# EAGLE schematic boardv2steer (EAGLE 6.6.0)
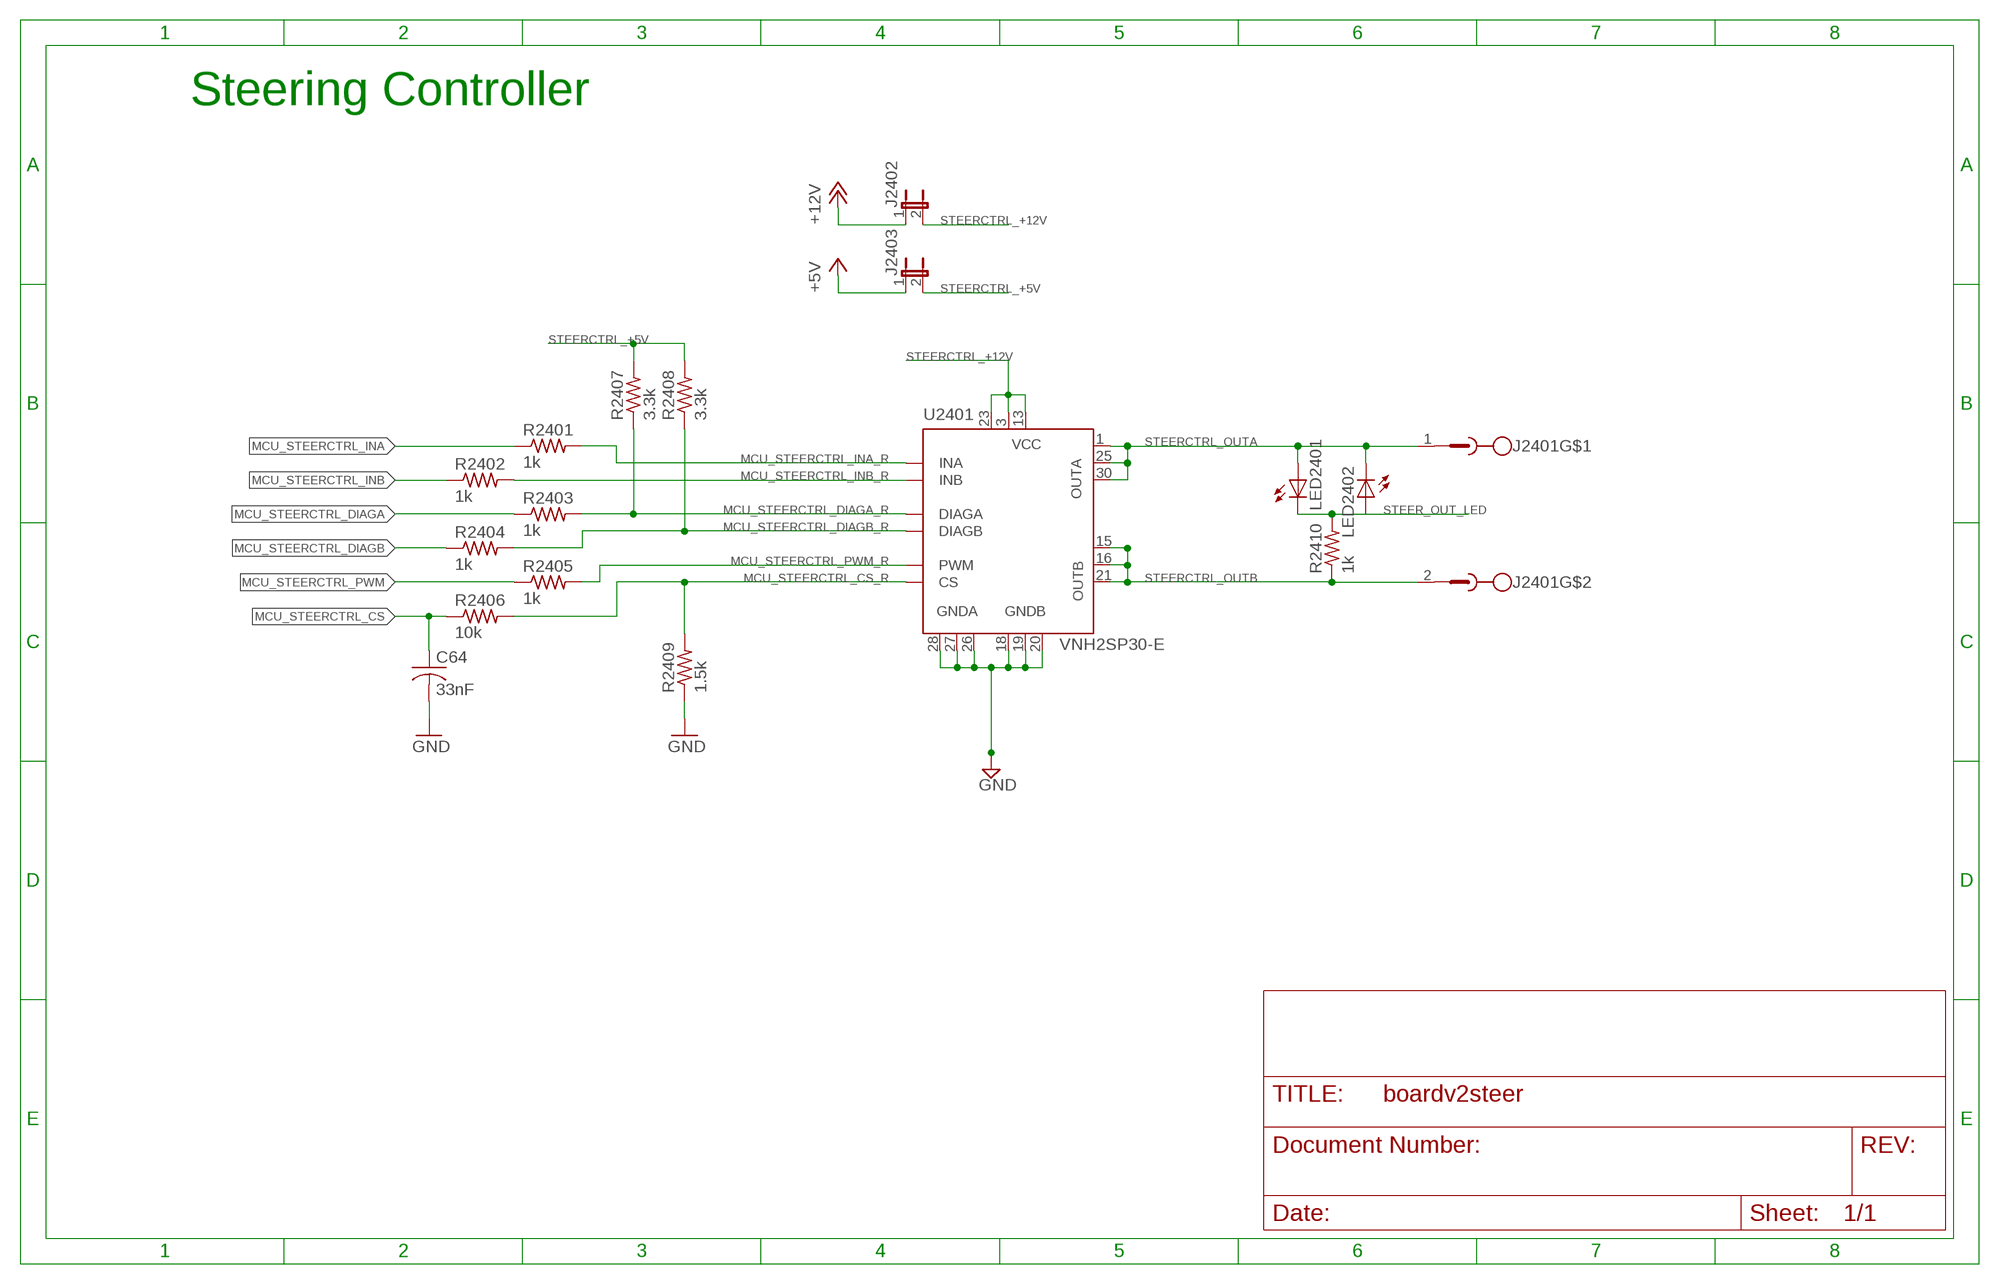
[diagram p0: schematic, sheet 1]

## Parts
C64  33nF  C-USC1206K  [C1206K]
J2401  PHOENIX_2POS_1792863  [PHOENIX_1792863]
J2402  JP1E  [JP1]
J2403  JP1E  [JP1]
LED2401  LEDSML1206  [SML1206]
LED2402  LEDSML1206  [SML1206]
R2401  1k  R-US_R1206W  [R1206W]
R2402  1k  R-US_R1206W  [R1206W]
R2403  1k  R-US_R1206W  [R1206W]
R2404  1k  R-US_R1206W  [R1206W]
R2405  1k  R-US_R1206W  [R1206W]
R2406  10k  R-US_R1206W  [R1206W]
R2407  3.3k  R-US_R1206W  [R1206W]
R2408  3.3k  R-US_R1206W  [R1206W]
R2409  1.5k  R-US_R1206W  [R1206W]
R2410  1k  R-US_R1206W  [R1206W]
U2401  VNH2SP30-E  [MULTIPOWERSO-30]

## Nets
+5V: J2403.1
+12V: J2402.1
GND: C64.2 R2409.1 U2401.18(GNDB) U2401.19(GNDB) U2401.20(GNDB) U2401.26(GNDA) U2401.27(GNDA) U2401.28(GNDA)
MCU_STEERCTRL_CS: C64.1 R2406.1
MCU_STEERCTRL_CS_R: R2406.2 R2409.2 U2401.9(CS)
MCU_STEERCTRL_DIAGA: R2403.1
MCU_STEERCTRL_DIAGA_R: R2403.2 R2407.1 U2401.6(DIAGA)
MCU_STEERCTRL_DIAGB: R2404.1
MCU_STEERCTRL_DIAGB_R: R2404.2 R2408.1 U2401.10(DIAGB)
MCU_STEERCTRL_INA: R2401.1
MCU_STEERCTRL_INA_R: R2401.2 U2401.5(INA)
MCU_STEERCTRL_INB: R2402.1
MCU_STEERCTRL_INB_R: R2402.2 U2401.11(INB)
MCU_STEERCTRL_PWM: R2405.1
MCU_STEERCTRL_PWM_R: R2405.2 U2401.8(PWM)
STEER_OUT_LED: LED2401.C LED2402.A R2410.2
STEERCTRL_+5V: J2403.2 R2407.2 R2408.2
STEERCTRL_+12V: J2402.2 U2401.3(VCC) U2401.13(VCC) U2401.23(VCC)
STEERCTRL_OUTA: J2401.1 LED2401.A LED2402.C U2401.1(OUTA) U2401.25(OUTA) U2401.30(OUTA)
STEERCTRL_OUTB: J2401.2 R2410.1 U2401.15(OUTB) U2401.16(OUTB) U2401.21(OUTB)

## Notes on the sheet
- Steering Controller

## Library data of the parts
C64 = rcl:C-US: CAPACITOR, American symbol
J2401 = Atlanta-Robotics LAPTOP:PHOENIX_2POS_1792863: Phoenix contact 2 position terminal block. 5mm pitch
J2402 J2403 = jumper:JP1E: JUMPER
LED2401 LED2402 = led:LED: LED OSRAM: - CHIPLED LG R971, LG N971, LY N971, LG Q971, LY Q971, LO R971, LY R971 LH N974, LH R974 LS Q976, LO Q976, LY Q976 LO Q996 - Hyper CHIPLED LW Q18S LB Q993, LB Q99A, LB R99A - SideLED LS A670, LO A670, LY A670, LG A670, LP A670 LB A673, LV A673, LT A673, LW A673 LH A674 LY A675 LS A676, LA A676, LO A676, LY A676, LW A676 LS A679, LY A679, LG A679 - Hyper Micro SIDELED® LS Y876, LA Y876, LO Y876, LY Y876 LT Y87S - SmartLED LW L88C, LW L88S LB L89C, LB L89S, LG L890 LS L89K, LO L89K, LY L89K LS L896, LA L896, LO L896, LY L896 - TOPLED LS T670, LO T670, LY T670, LG T670, LP T670 LSG T670, LSP T670, LSY T670, LOP T670, LYG T670 LG T671, LOG T671, LSG T671 LB T673, LV T673, LT T673, LW T673 LH T674 LS T676, LA T676, LO T676, LY T676, LB T676, LH T676, LSB T676, LW T676 LB T67C, LV T67C, LT T67C, LS T67K, LO T67K, LY T67K, LW E67C LS E67B, LA E67B, LO E67B, LY E67B, LB E67C, LV E67C, LT E67C LW T67C LS T679, LY T679, LG T679 LS T770, LO T770, LY T770, LG T770, LP T770 LB T773, LV T773, LT T773, LW T773 LH T774 LS E675, LA E675, LY E675, LS T675 LS T776, LA T776, LO T776, LY T776, LB T776 LHGB T686 LT T68C, LB T68C - Hyper Mini TOPLED® LB M676 - Mini TOPLED Santana® LG M470 LS M47K, LO M47K, LY M47K Source: http://www.osram.convergy.de LUXEON: - LUMILED® LXK2-PW12-R00, LXK2-PW12-S00, LXK2-PW14-U00, LXK2-PW14-V00 LXK2-PM12-R00, LXK2-PM12-S00, LXK2-PM14-U00 LXK2-PE12-Q00, LXK2-PE12-R00, LXK2-PE12-S00, LXK2-PE14-T00, LXK2-PE14-U00 LXK2-PB12-K00, LXK2-PB12-L00, LXK2-PB12-M00, LXK2-PB14-N00, LXK2-PB14-P00, LXK2-PB14-Q00 LXK2-PR12-L00, LXK2-PR12-M00, LXK2-PR14-Q00, LXK2-PR14-R00 LXK2-PD12-Q00, LXK2-PD12-R00, LXK2-PD12-S00 LXK2-PH12-R00, LXK2-PH12-S00 LXK2-PL12-P00, LXK2-PL12-Q00, LXK2-PL12-R00 Source: www.luxeon.com KINGBRIGHT: KA-3528ASYC Source: www.kingbright.com
R2401-R2410 = rcl:R-US_: RESISTOR, American symbol
U2401 = st-microelectronics:VNH2SP30-E: VNH2SP30-E St Microelectronics Automotive 12v motor driver

## Net classes
0 default: width 0.203 mm, drill 0.406 mm, clearance 0.102 mm